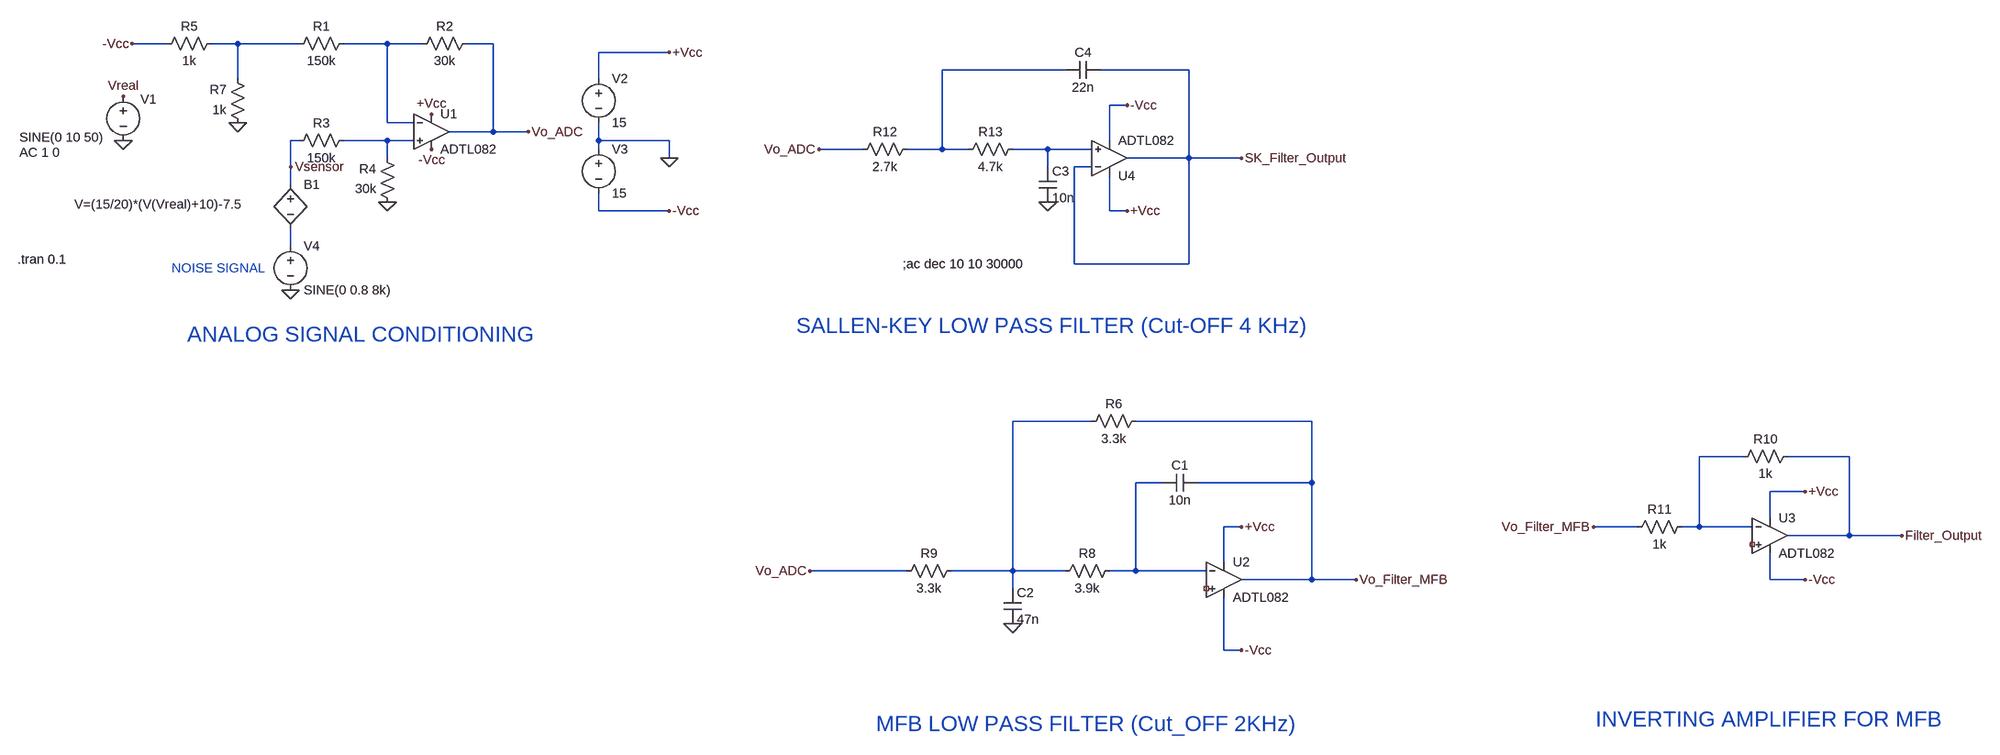
[diagram p0: schematic Signal_Conditioning_Filtering.asc]
Signal_Conditioning_Filtering.asc, the LTspice schematic file:
Version 4
SHEET 1 3356 1444
WIRE -304 16 -368 16
WIRE -176 16 -224 16
WIRE -64 16 -176 16
WIRE 96 16 16 16
WIRE 160 16 96 16
WIRE 288 16 240 16
WIRE 608 32 480 32
WIRE 1328 64 1104 64
WIRE 1552 64 1392 64
WIRE -176 80 -176 16
WIRE 480 80 480 32
WIRE 1440 128 1408 128
WIRE 96 160 96 16
WIRE 144 160 96 160
WIRE 288 176 288 16
WIRE 288 176 208 176
WIRE 352 176 288 176
WIRE -64 192 -80 192
WIRE 96 192 16 192
WIRE 144 192 96 192
WIRE 480 192 480 160
WIRE 608 192 480 192
WIRE 1408 192 1408 128
WIRE 480 208 480 192
WIRE 960 208 880 208
WIRE 1104 208 1104 64
WIRE 1104 208 1040 208
WIRE 1152 208 1104 208
WIRE 1296 208 1232 208
WIRE 1376 208 1296 208
WIRE 96 224 96 192
WIRE 608 224 608 192
WIRE 1552 224 1552 64
WIRE 1552 224 1440 224
WIRE 1648 224 1552 224
WIRE -80 240 -80 192
WIRE 1296 240 1296 208
WIRE 1376 240 1344 240
WIRE -80 272 -80 240
WIRE 480 320 480 288
WIRE 608 320 480 320
WIRE 1408 320 1408 256
WIRE 1440 320 1408 320
WIRE -80 384 -80 352
WIRE 1344 416 1344 240
WIRE 1552 416 1552 224
WIRE 1552 416 1344 416
WIRE 1376 832 1232 832
WIRE 1776 832 1456 832
WIRE 2560 896 2480 896
WIRE 2752 896 2640 896
WIRE 1504 944 1456 944
WIRE 1776 944 1776 832
WIRE 1776 944 1568 944
WIRE 2672 960 2608 960
WIRE 2608 1008 2608 960
WIRE 1648 1024 1616 1024
WIRE 2368 1024 2288 1024
WIRE 2480 1024 2480 896
WIRE 2480 1024 2448 1024
WIRE 2576 1024 2480 1024
WIRE 2752 1040 2752 896
WIRE 2752 1040 2640 1040
WIRE 2848 1040 2752 1040
WIRE 1616 1088 1616 1024
WIRE 1040 1104 864 1104
WIRE 1232 1104 1232 832
WIRE 1232 1104 1120 1104
WIRE 1328 1104 1232 1104
WIRE 1456 1104 1456 944
WIRE 1456 1104 1408 1104
WIRE 1584 1104 1456 1104
WIRE 1776 1120 1776 944
WIRE 1776 1120 1648 1120
WIRE 1856 1120 1776 1120
WIRE 2608 1120 2608 1072
WIRE 2672 1120 2608 1120
WIRE 1232 1136 1232 1104
WIRE 1616 1248 1616 1152
WIRE 1648 1248 1616 1248
FLAG -384 112 Vreal
FLAG 608 32 +Vcc
FLAG 608 320 -Vcc
FLAG 176 144 +Vcc
FLAG 176 208 -Vcc
FLAG 352 176 Vo_ADC
FLAG -368 16 -Vcc
FLAG -80 240 Vsensor
FLAG 1856 1120 Vo_Filter_MFB
FLAG 1648 1024 +Vcc
FLAG 1648 1248 -Vcc
FLAG 864 1104 Vo_ADC
FLAG 2288 1024 Vo_Filter_MFB
FLAG 2672 960 +Vcc
FLAG 2672 1120 -Vcc
FLAG 2848 1040 Filter_Output
FLAG 1440 128 -Vcc
FLAG 1440 320 +Vcc
FLAG 880 208 Vo_ADC
FLAG 1648 224 SK_Filter_Output
FLAG -80 464 0
FLAG 96 304 0
FLAG 1296 304 0
FLAG 1232 1200 0
FLAG 608 224 0
FLAG -176 160 0
FLAG -384 192 0
SYMBOL voltage -384 96 R0
WINDOW 0 31 21 Left 2
WINDOW 3 -189 90 Left 2
WINDOW 123 -189 118 Left 2
WINDOW 39 0 0 Left 0
SYMATTR InstName V1
SYMATTR Value SINE(0 10 50)
SYMATTR Value2 AC 1 0
SYMBOL OpAmps\\ADTL082 176 112 R0
SYMATTR InstName U1
SYMBOL res 32 0 R90
WINDOW 0 0 56 VBottom 2
WINDOW 3 32 56 VTop 2
SYMATTR InstName R1
SYMATTR Value 150k
SYMBOL res 256 0 R90
WINDOW 0 0 56 VBottom 2
WINDOW 3 32 56 VTop 2
SYMATTR InstName R2
SYMATTR Value 30k
SYMBOL res 32 176 R90
WINDOW 0 0 56 VBottom 2
WINDOW 3 32 56 VTop 2
SYMATTR InstName R3
SYMATTR Value 150k
SYMBOL res 112 320 R180
WINDOW 0 36 76 Left 2
WINDOW 3 36 40 Left 2
SYMATTR InstName R4
SYMATTR Value 30k
SYMBOL voltage 480 64 R0
WINDOW 123 0 0 Left 0
WINDOW 39 0 0 Left 0
SYMATTR InstName V2
SYMATTR Value 15
SYMBOL voltage 480 192 R0
WINDOW 123 0 0 Left 0
WINDOW 39 0 0 Left 0
SYMATTR InstName V3
SYMATTR Value 15
SYMBOL res -208 0 R90
WINDOW 0 0 56 VBottom 2
WINDOW 3 32 56 VTop 2
SYMATTR InstName R5
SYMATTR Value 1k
SYMBOL res -160 176 R180
WINDOW 0 36 76 Left 2
WINDOW 3 36 40 Left 2
SYMATTR InstName R7
SYMATTR Value 1k
SYMBOL bv -80 256 R0
WINDOW 3 -393 52 Left 2
SYMATTR Value V=(15/20)*(V(Vreal)+10)-7.5
SYMATTR InstName B1
SYMBOL OpAmps\\ADTL082 1616 1056 R0
SYMATTR InstName U2
SYMBOL res 1472 816 R90
WINDOW 0 0 56 VBottom 2
WINDOW 3 32 56 VTop 2
SYMATTR InstName R6
SYMATTR Value 3.3k
SYMBOL res 1136 1088 R90
WINDOW 0 0 56 VBottom 2
WINDOW 3 32 56 VTop 2
SYMATTR InstName R9
SYMATTR Value 3.3k
SYMBOL cap 1216 1136 R0
SYMATTR InstName C2
SYMATTR Value 47n
SYMBOL cap 1568 928 R90
WINDOW 0 0 32 VBottom 2
WINDOW 3 32 32 VTop 2
SYMATTR InstName C1
SYMATTR Value 10n
SYMBOL res 1424 1088 R90
WINDOW 0 0 56 VBottom 2
WINDOW 3 32 56 VTop 2
SYMATTR InstName R8
SYMATTR Value 3.9k
SYMBOL OpAmps\\ADTL082 2608 976 R0
SYMATTR InstName U3
SYMBOL res 2656 880 R90
WINDOW 0 0 56 VBottom 2
WINDOW 3 32 56 VTop 2
SYMATTR InstName R10
SYMATTR Value 1k
SYMBOL res 2464 1008 R90
WINDOW 0 0 56 VBottom 2
WINDOW 3 32 56 VTop 2
SYMATTR InstName R11
SYMATTR Value 1k
SYMBOL OpAmps\\ADTL082 1408 288 M180
SYMATTR InstName U4
SYMBOL res 1056 192 R90
WINDOW 0 0 56 VBottom 2
WINDOW 3 32 56 VTop 2
SYMATTR InstName R12
SYMATTR Value 2.7k
SYMBOL res 1248 192 R90
WINDOW 0 0 56 VBottom 2
WINDOW 3 32 56 VTop 2
SYMATTR InstName R13
SYMATTR Value 4.7k
SYMBOL cap 1280 240 R0
SYMATTR InstName C3
SYMATTR Value 10n
SYMBOL cap 1392 48 R90
WINDOW 0 0 32 VBottom 2
WINDOW 3 32 32 VTop 2
SYMATTR InstName C4
SYMATTR Value 22n
SYMBOL voltage -80 368 R0
WINDOW 123 24 124 Left 2
WINDOW 39 0 0 Left 0
SYMATTR InstName V4
SYMATTR Value SINE(0 0.8 8k)
TEXT -576 408 Left 2 !.tran 0.1
TEXT 1368 1416 Center 4 ;MFB LOW PASS FILTER (Cut_OFF 2KHz)
TEXT 48 544 Center 4 ;ANALOG SIGNAL CONDITIONING
TEXT 2608 1408 Center 4 ;INVERTING AMPLIFIER FOR MFB
TEXT 1304 528 Center 4 ;SALLEN-KEY LOW PASS FILTER (Cut-OFF 4 KHz)
TEXT -296 424 Left 2 ;NOISE SIGNAL
TEXT 1032 416 Left 2 !;ac dec 10 10 30000

The netlist it stands for:
* Signal_Conditioning_Filtering.asc
V1 Vreal 0 SINE(0 10 50) AC 1 0
XU1 N004 N002 +Vcc -Vcc Vo_ADC ADTL082  ; pins In+ In- V+ V- OUT
R1 N002 N001 150k
R2 Vo_ADC N002 30k
R3 N004 Vsensor 150k
R4 0 N004 30k
V2 +Vcc 0 15
V3 0 -Vcc 15
R5 N001 -Vcc 1k
R7 0 N001 1k
B1 Vsensor N006 V=(15/20)*(V(Vreal)+10)-7.5
XU2 NC_01 N009 +Vcc -Vcc Vo_Filter_MFB ADTL082  ; pins In+ In- V+ V- OUT
R6 Vo_Filter_MFB N007 3.3k
R9 N007 Vo_ADC 3.3k
C2 N007 0 47n
C1 Vo_Filter_MFB N009 10n
R8 N009 N007 3.9k
XU3 NC_02 N008 +Vcc -Vcc Filter_Output ADTL082  ; pins In+ In- V+ V- OUT
R10 Filter_Output N008 1k
R11 N008 Vo_Filter_MFB 1k
XU4 N005 SK_Filter_Output +Vcc -Vcc SK_Filter_Output ADTL082  ; pins In+ In- V+ V- OUT
R12 N003 Vo_ADC 2.7k
R13 N005 N003 4.7k
C3 N005 0 10n
C4 SK_Filter_Output N003 22n
V4 N006 0 SINE(0 0.8 8k)
.tran 0.1
* MFB LOW PASS FILTER (Cut_OFF 2KHz)
* ANALOG SIGNAL CONDITIONING
* INVERTING AMPLIFIER FOR MFB
* SALLEN-KEY LOW PASS FILTER (Cut-OFF 4 KHz)
* NOISE SIGNAL
;ac dec 10 10 30000
.lib ADI.lib
.backanno
.end